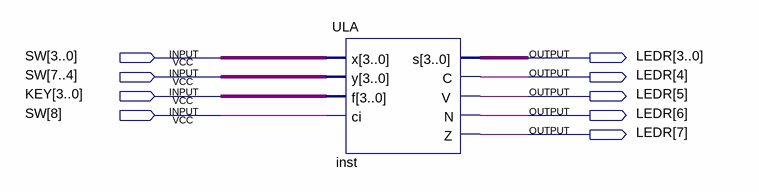
[diagram p0: schematic sheet]
// Quartus schematic ULA_teste.bdf as structural Verilog: 1 symbols, 9 pins
module ULA_teste (
  input  [8:0] SW,
  input  [3:0] KEY,
  output [7:0] LEDR
);

  ULA inst (
    .x(SW[3:0]), .y(SW[7:4]), .f(KEY), .ci(SW[8]), .s(LEDR[3:0]), .C(LEDR[4]), .V(LEDR[5]), .N(LEDR[6]),
    .Z(LEDR[7]));
endmodule
